# EAGLE design ram (EAGLE 9.6.2)
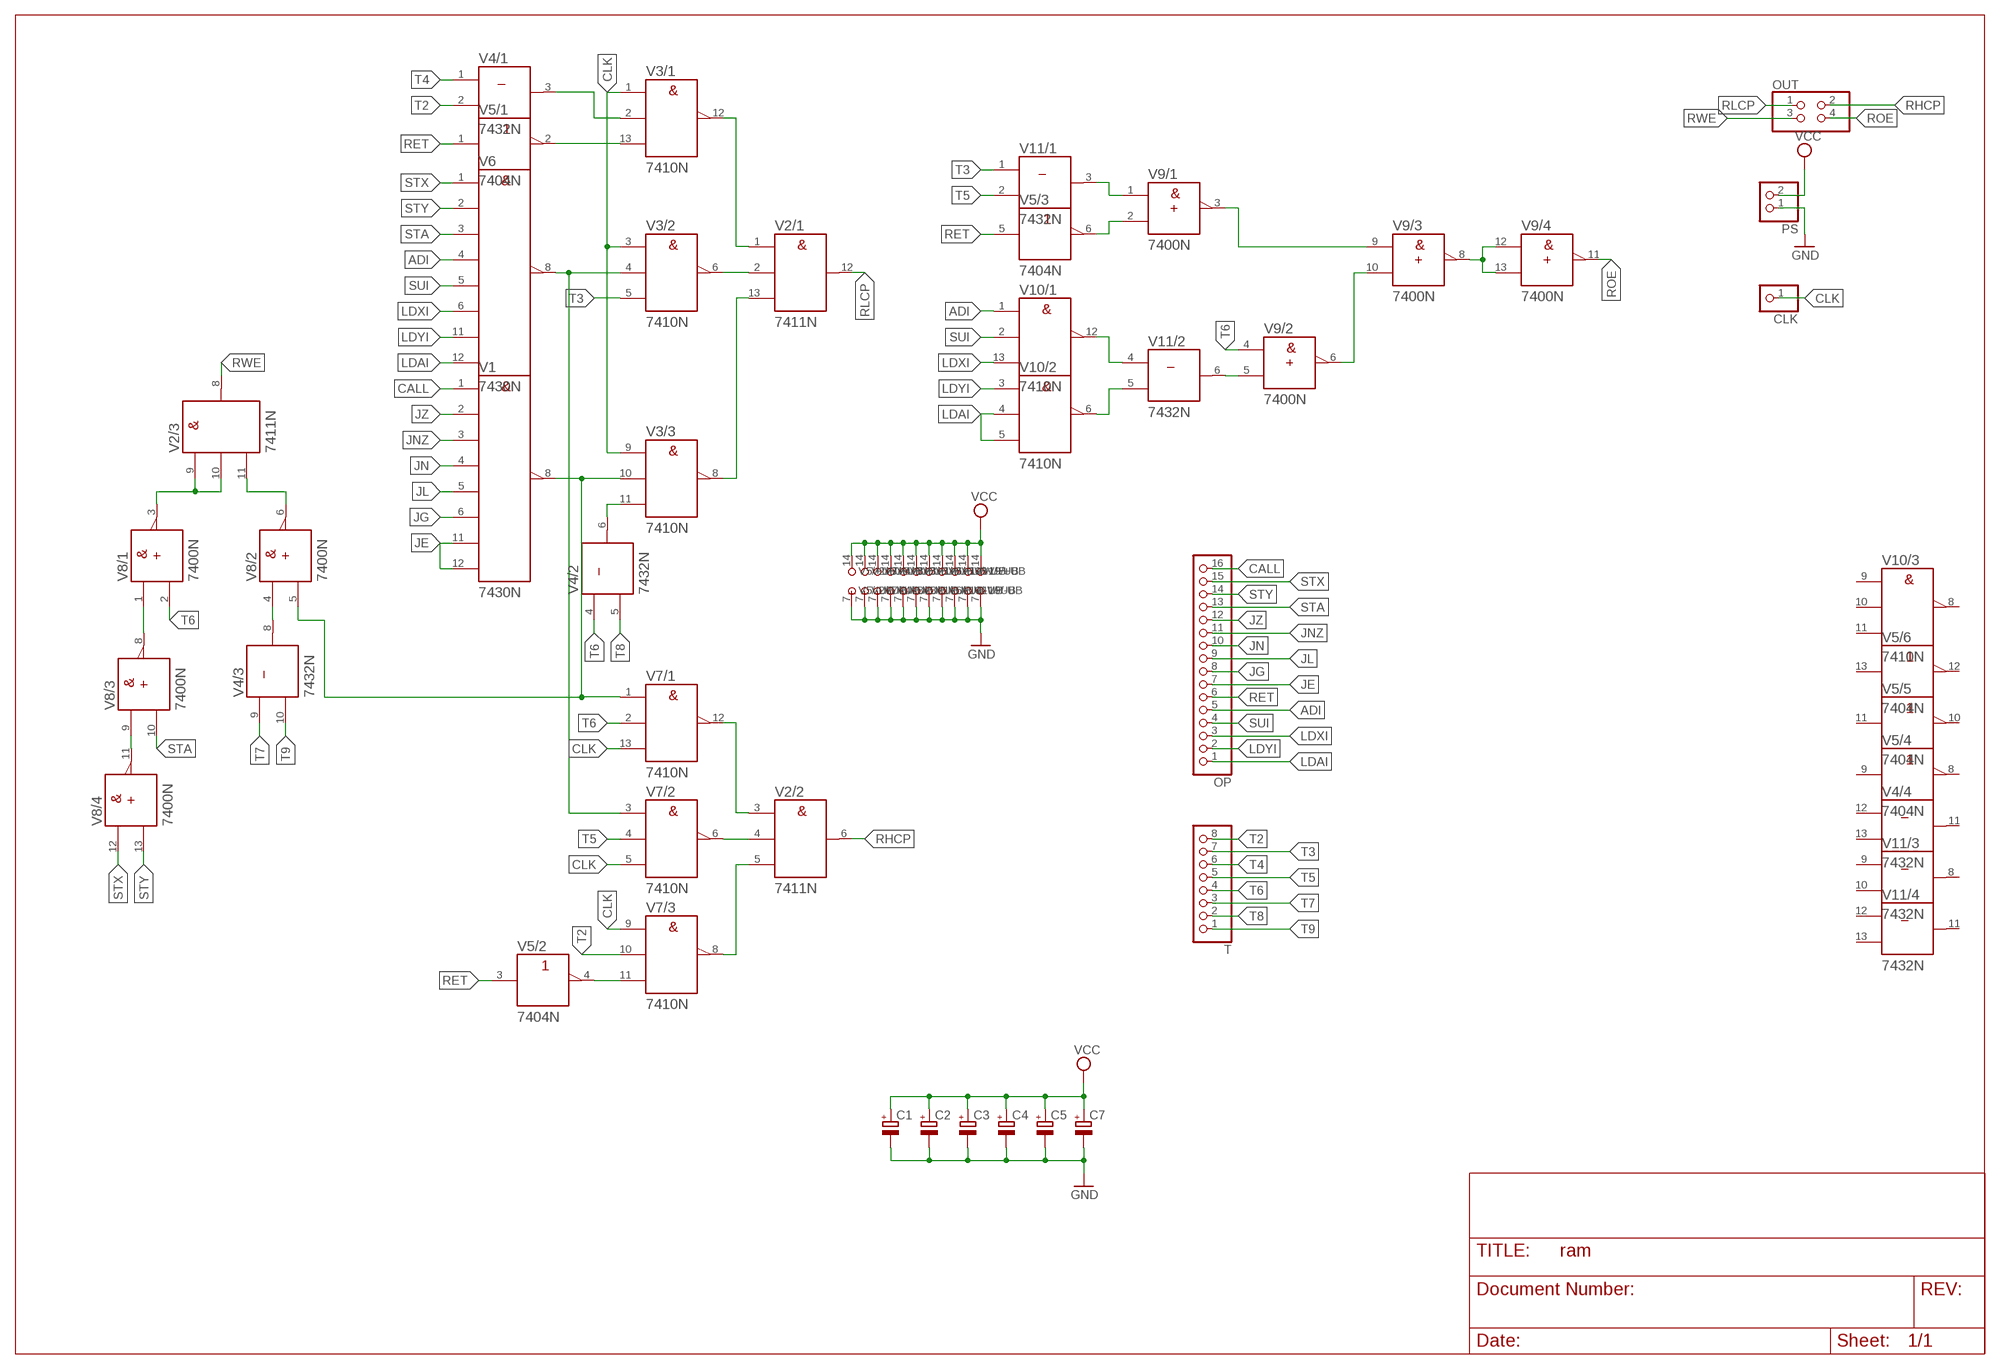
[diagram p0: schematic, sheet 1]

## Parts
C1  CPOL-EUE2.5-6  [E2,5-6]
C2  CPOL-EUE2.5-6  [E2,5-6]
C3  CPOL-EUE2.5-6  [E2,5-6]
C4  CPOL-EUE2.5-6  [E2,5-6]
C5  CPOL-EUE2.5-6  [E2,5-6]
C7  CPOL-EUE2.5-6  [E2,5-6]
CLK  PINHD-1X1  [1X01]
OP  PINHD-1X16  [1X16]
OUT  PINHD-2X2  [2X02]
PS  PINHD-1X2  [1X02]
T  PINHD-1X8  [1X08]
V1  7430N  [DIL14]
V2  7411N  [DIL14]
V3  7410N  [DIL14]
V4  7432N  [DIL14]
V5  7404N  [DIL14]
V6  7430N  [DIL14]
V7  7410N  [DIL14]
V8  7400N  [DIL14]
V9  7400N  [DIL14]
V10  7410N  [DIL14]
V11  7432N  [DIL14]

## Nets
ADI: OP.5 V6.4(D) V10.1(/1:A)
CALL: OP.16 V1.1(A)
CLK: CLK.1 V3.1(/1:A) V3.3(/2:A) V3.9(/3:A) V7.5(/2:C) V7.9(/3:A) V7.13(/1:C)
GND: C1.- C2.- C3.- C4.- C5.- C7.- PS.1 V1.7(-UB) V2.7(/-UB:-UB) V3.7(/-UB:-UB) V4.7(/-UB:-UB) V5.7(/-UB:-UB) V6.7(-UB) V7.7(/-UB:-UB) V8.7(/-UB:-UB) V9.7(/-UB:-UB) V10.7(/-UB:-UB) V11.7(/-UB:-UB)
JE: OP.7 V1.11(G) V1.12(H)
JG: OP.8 V1.6(F)
JL: OP.9 V1.5(E)
JN: OP.10 V1.4(D)
JNZ: OP.11 V1.3(C)
JZ: OP.12 V1.2(B)
LDAI: OP.1 V6.12(H) V10.4(/2:B) V10.5(/2:C)
LDXI: OP.3 V6.6(F) V10.13(/1:C)
LDYI: OP.2 V6.11(G) V10.3(/2:A)
N$1: V2.5(/2:C) V7.8(/3:Y)
N$2: V2.2(/1:B) V3.6(/2:Y)
N$3: V2.1(/1:A) V3.12(/1:Y)
N$4: V2.13(/1:C) V3.8(/3:Y)
N$5: V3.2(/1:B) V4.3(/1:Y)
N$6: V3.13(/1:C) V5.2(/1:Y)
N$7: V3.4(/2:B) V6.8(Y) V7.3(/2:A)
N$8: V9.1(/1:A) V11.3(/1:Y)
N$9: V2.4(/2:B) V7.6(/2:Y)
N$10: V3.11(/3:C) V4.6(/2:Y)
N$11: V2.3(/2:A) V7.12(/1:Y)
N$12: V2.9(/3:A) V2.10(/3:B) V8.3(/1:Y)
N$13: V2.11(/3:C) V8.6(/2:Y)
N$14: V5.4(/2:Y) V7.11(/3:C)
N$15: V9.3(/1:Y) V9.9(/3:A)
N$16: V9.5(/2:B) V11.6(/2:Y)
N$17: V8.9(/3:A) V8.11(/4:Y)
N$18: V4.8(/3:Y) V8.4(/2:A)
N$19: V8.1(/1:A) V8.8(/3:Y)
N$20: V1.8(Y) V3.10(/3:B) V7.1(/1:A) V8.5(/2:B)
N$21: V5.6(/3:Y) V9.2(/1:B)
N$22: V9.8(/3:Y) V9.12(/4:A) V9.13(/4:B)
N$23: V10.6(/2:Y) V11.5(/2:B)
N$24: V10.12(/1:Y) V11.4(/2:A)
N$25: V9.6(/2:Y) V9.10(/3:B)
RET: OP.6 V5.1(/1:A) V5.3(/2:A) V5.5(/3:A)
RHCP: OUT.2 V2.6(/2:Y)
RLCP: OUT.1 V2.12(/1:Y)
ROE: OUT.4 V9.11(/4:Y)
RWE: OUT.3 V2.8(/3:Y)
STA: OP.13 V6.3(C) V8.10(/3:B)
STX: OP.15 V6.1(A) V8.12(/4:A)
STY: OP.14 V6.2(B) V8.13(/4:B)
SUI: OP.4 V6.5(E) V10.2(/1:B)
T2: T.8 V4.2(/1:B) V7.10(/3:B)
T3: T.7 V3.5(/2:C) V11.1(/1:A)
T4: T.6 V4.1(/1:A)
T5: T.5 V7.4(/2:B) V11.2(/1:B)
T6: T.4 V4.4(/2:A) V7.2(/1:B) V8.2(/1:B) V9.4(/2:A)
T7: T.3 V4.9(/3:A)
T8: T.2 V4.5(/2:B)
T9: T.1 V4.10(/3:B)
VCC: C1.+ C2.+ C3.+ C4.+ C5.+ C7.+ PS.2 V1.14(+UB) V2.14(/+UB:+UB) V3.14(/+UB:+UB) V4.14(/+UB:+UB) V5.14(/+UB:+UB) V6.14(+UB) V7.14(/+UB:+UB) V8.14(/+UB:+UB) V9.14(/+UB:+UB) V10.14(/+UB:+UB) V11.14(/+UB:+UB)
Unconnected: V4.11(/4:Y) V4.12(/4:A) V4.13(/4:B) V5.8(/4:Y) V5.9(/4:A) V5.10(/5:Y) V5.11(/5:A) V5.12(/6:Y) V5.13(/6:A) V10.8(/3:Y) V10.9(/3:A) V10.10(/3:B) V10.11(/3:C) V11.8(/3:Y) V11.9(/3:A) V11.10(/3:B) V11.11(/4:Y) V11.12(/4:A) V11.13(/4:B)

## Library data of the parts
C1-C5 C7 = rcl:CPOL-EU: POLARIZED CAPACITOR, European symbol; SPICEPREFIX: C
CLK = pinhead:PINHD-1X1: PIN HEADER
OP = pinhead:PINHD-1X16: PIN HEADER
OUT = pinhead:PINHD-2X2: PIN HEADER
PS = pinhead:PINHD-1X2: PIN HEADER
T = pinhead:PINHD-1X8: PIN HEADER
V1 V6 = 74ttl-din:74*30: 8-input NAND gate
V2 = 74ttl-din:74*11: Triple 3-input AND gate
V3 V7 V10 = 74ttl-din:74*10: Triple 3-input NAND gate
V4 V11 = 74ttl-din:74*32: Quad 2-input OR gate
V5 = 74ttl-din:74*04: Hex INVERTER
V8 V9 = 74ttl-din:74*00: Quad 2-input NAND gate

## Board
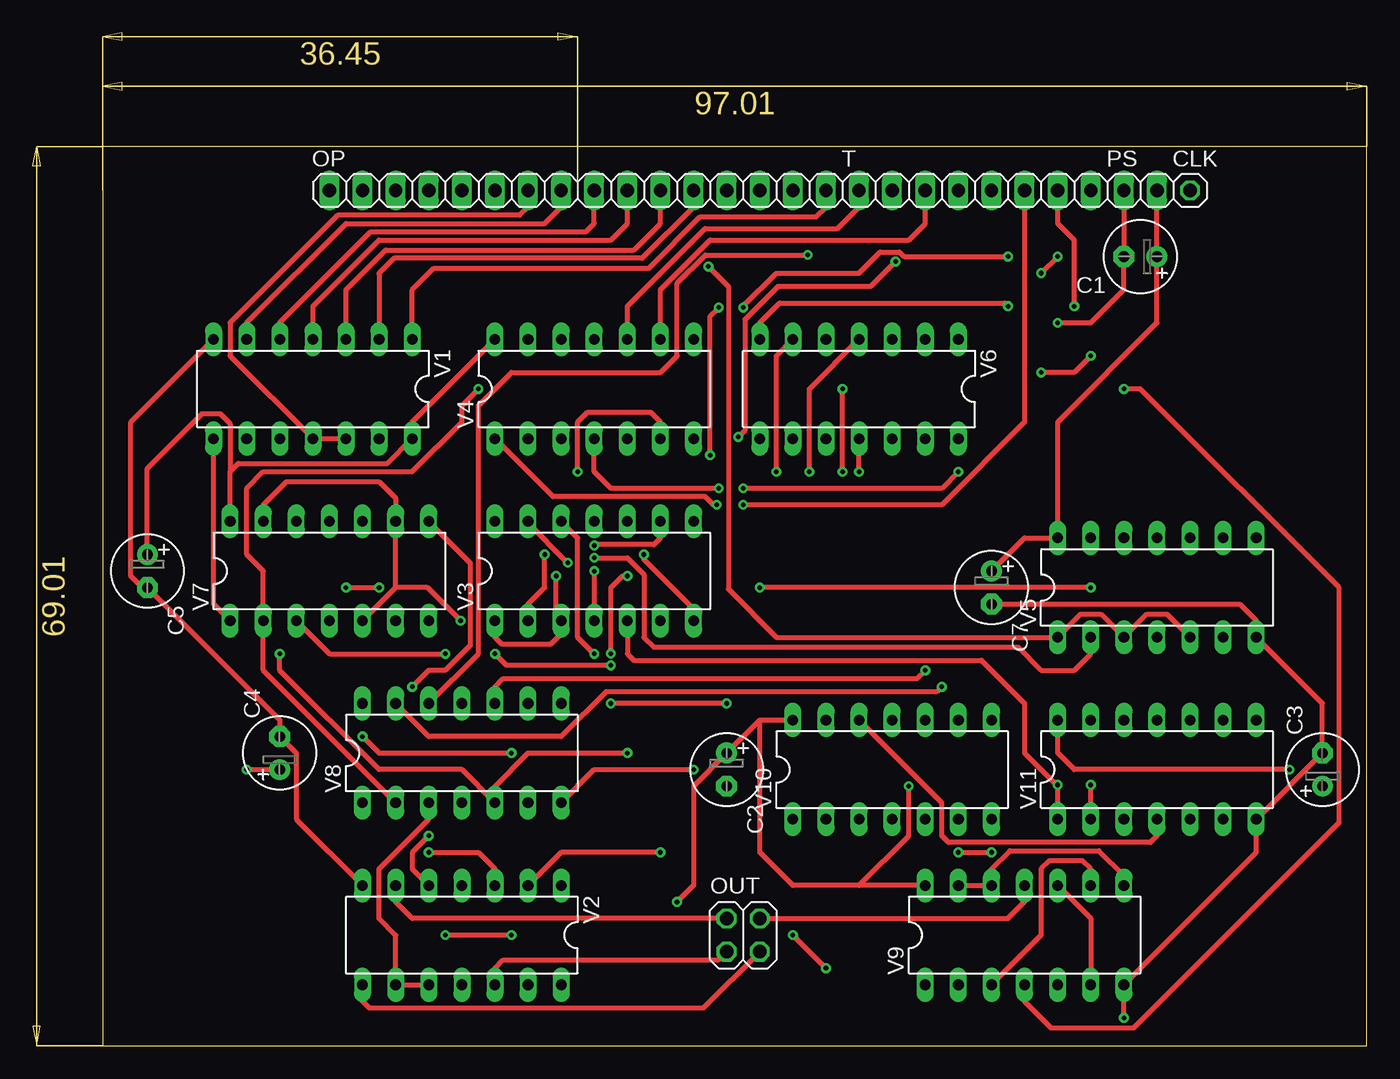
[diagram p1: board, top side]
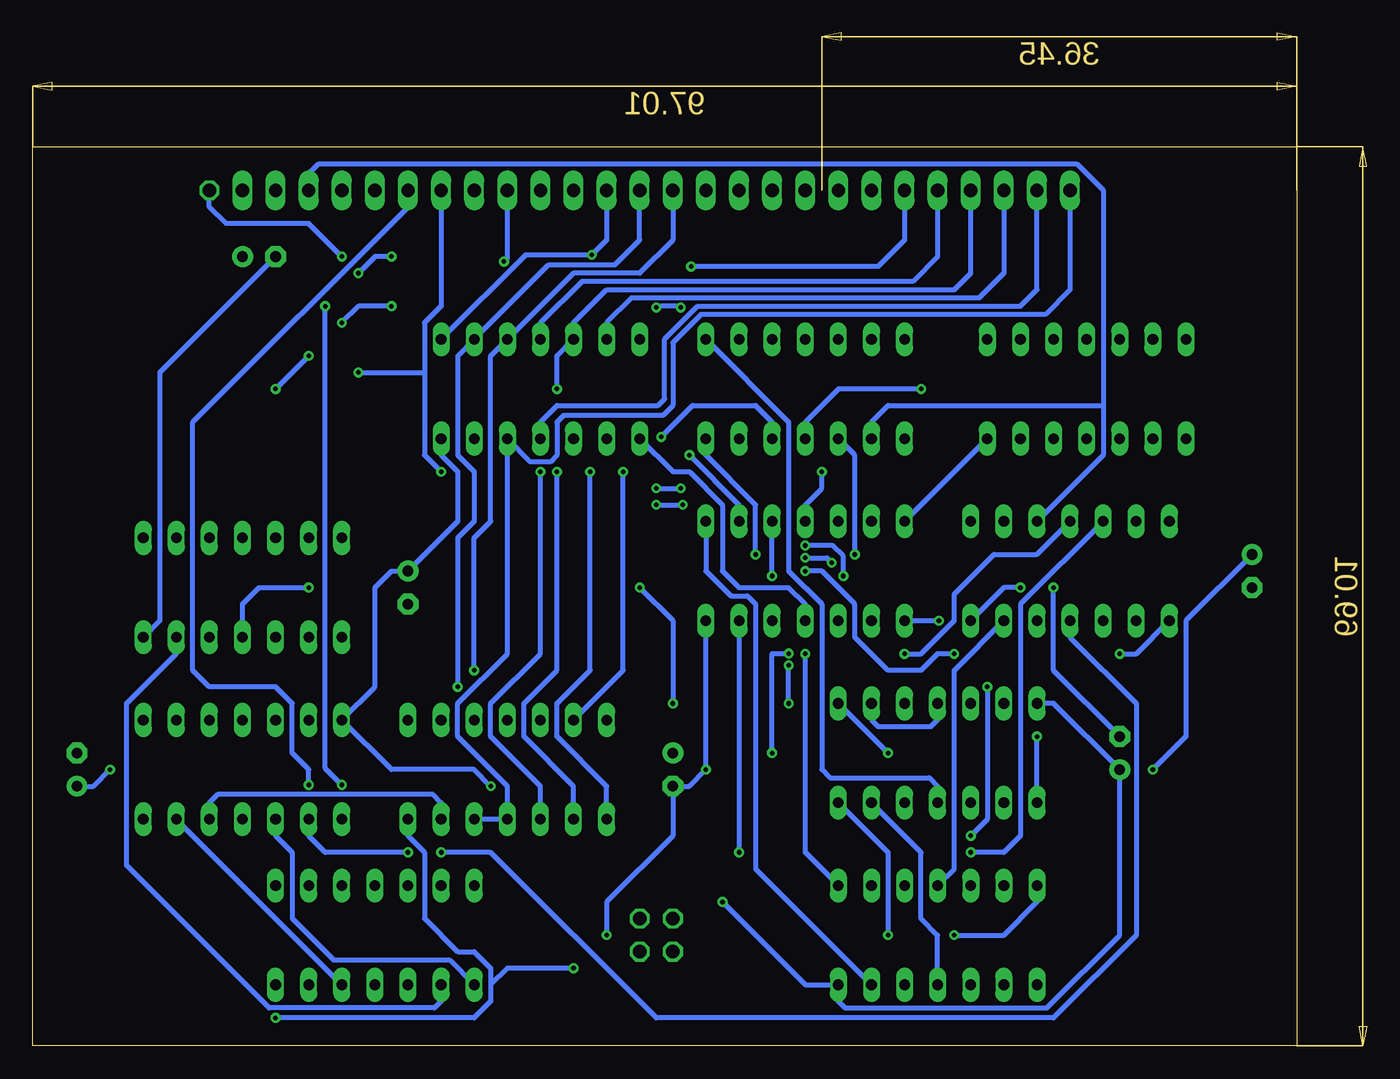
[diagram p2: board, bottom side, seen from below]

Size 97.01 x 69.01 mm. Coordinates in mm from the lower left corner, seen from the top.
Outline: 0,0 97.01,0 97.01,69.01 0,69.01 0,0
Copper layers (1*16): Top 0.035mm / dielectric 1.5mm / Bottom 0.035mm
Design rules "default": minimum track width 6mil, minimum drill 0.35mm, track to track 6mil, track to pad 6mil, pad to pad 6mil, via to via 6mil, smd to smd 6mil, copper to edge 40mil, drill to drill 6mil, minimum pad ring 10mil, minimum via ring 8mil, stop-mask expansion 4mil, vias tented up to drill 0mil, thermal gap 10mil

### Footprints (pad centres in the part's own frame; a part is rotated, then mirrored left to right if it is on the bottom)
E2,5-6 = drill 0.813 pad 1.6: + -1.27,0 | drill 0.813 pad 1.6 octagon: - 1.27,0
1X01 = drill 1.016 octagon: 1 0,0
1X16 = drill 1.016 long: 1 -19.05,0; 2 -16.51,0; 3 -13.97,0; 4 -11.43,0; 5 -8.89,0; 6 -6.35,0; 7 -3.81,0; 8 -1.27,0; 9 1.27,0; 10 3.81,0; 11 6.35,0; 12 8.89,0; 13 11.43,0; 14 13.97,0; 15 16.51,0; 16 19.05,0
2X02 = drill 1.016 octagon: 1 -1.27,-1.27; 2 -1.27,1.27; 3 1.27,-1.27; 4 1.27,1.27
1X02 = drill 1.016 long: 1 -1.27,0; 2 1.27,0
1X08 = drill 1.016 long: 1 -8.89,0; 2 -6.35,0; 3 -3.81,0; 4 -1.27,0; 5 1.27,0; 6 3.81,0; 7 6.35,0; 8 8.89,0
DIL14 = drill 0.813 long: 1 -7.62,-3.81; 2 -5.08,-3.81; 3 -2.54,-3.81; 4 0,-3.81; 5 2.54,-3.81; 6 5.08,-3.81; 7 7.62,-3.81; 8 7.62,3.81; 9 5.08,3.81; 10 2.54,3.81; 11 0,3.81; 12 -2.54,3.81; 13 -5.08,3.81; 14 -7.62,3.81

### Placement (x,y rotation side)
C1  79.63,60.58 180 top
C2  47.88,21.21 270 top
C3  93.6,21.21 90 top
C4  13.59,22.48 90 top
C5  3.43,36.45 270 top
C7  68.2,35.18 270 top
CLK  83.44,65.66 0 top
OP  36.45,65.66 0 top
OUT  49.15,8.51 0 top
PS  79.63,65.66 0 top
T  66.93,65.66 0 top
V1  16.13,50.42 180 top
V2  27.56,8.51 180 top
V3  37.72,36.45 0 top
V4  37.72,50.42 0 top
V5  80.9,35.18 0 top
V6  58.04,50.42 180 top
V7  17.4,36.45 0 top
V8  27.56,22.48 0 top
V9  70.74,8.51 0 top
V10  60.58,21.21 0 top
V11  80.9,21.21 0 top

### Tracks (layer width: path | path; a pad name or v marks a point on that pad's centre or on a via)
ADI  (via drill 0.35)
  Top 0.4: v54.23,44.07 54.23,50.42 V6.4
  Bottom 0.4: OP.5 27.56,60.58 29.46,58.67 54.86,58.67 58.04,55.5 V6.4 | V10.1 52.96,19.94 56.77,23.75 56.77,26.29 54.23,28.83 v54.23,44.07
CALL
  Top 0.4: OP.16 55.5,64.39 54.74,63.63 45.85,63.63 41.91,59.69 25.4,59.69 23.75,58.04 V1.1
CLK  (via drill 0.35)
  Top 0.4: V7.13 12.32,41.53 14.1,43.31 21.21,43.31 22.48,42.04 V7.9 22.48,35.18 | V7.5 22.48,35.18 | V3.1 30.1,31.37 30.61,30.86 34.42,30.86 35.18,31.62 V3.3 34.8,33.02 v34.8,36.07 | v46.61,45.34 46.61,56.01 v47.27,56.67 | v49.15,56.67 49.15,56.77 51.69,59.31 58.04,59.31 59.66,60.93 61.14,60.93 61.48,60.58 v69.47,60.58 | v72.01,59.31 v73.28,60.58 | v27.46,32.64 24.92,35.18 22.48,35.18 | V3.9 42.8,38.99 42.29,38.48 37.79,38.48 v37.72,38.41
  Bottom 0.4: V3.9 42.8,41.53 v46.61,45.34 | v47.27,56.67 47.37,56.77 49.15,56.77 v49.15,56.67 | v69.47,60.58 70.74,60.58 v72.01,59.31 | v73.28,60.58 75.82,63.12 82.17,63.12 83.44,64.39 CLK.1 | V3.1 v27.46,32.64 | v34.8,36.07 34.8,37.59 35.61,38.41 v37.72,38.41
GND  (via drill 0.35)
  Top 0.4: V1.7 2.16,47.88 2.16,36.07 3.05,35.18 C5.- 13.59,25.02 C4.- 14.86,22.48 14.86,17.4 V2.7 | C7.- 87.25,33.91 88.52,32.64 V5.7 93.6,26.29 C3.- V11.7 88.52,14.86 V9.7 v78.36,2.16 | PS.1 C1.- 78.36,58.04 75.82,55.5 v73.28,55.5 | V6.7 50.42,55.5 51.94,57.02 69.22,57.02 v69.47,56.77 | V3.7 45.34,33.53 41.53,37.34 v41.53,37.72 | v31.37,8.51 v26.29,8.51 | V8.7 37.72,21.21 v45.34,21.21 | v18.67,35.18 v21.21,35.18 | v52.96,8.51 v55.5,5.97
  Bottom 0.4: V10.7 68.2,16.13 66.93,14.86 66.93,9.78 64.39,7.24 63.12,7.24 61.85,5.97 61.85,4.7 | 61.85,4.7 61.85,3.43 63.12,2.16 v78.36,2.16 | v69.47,56.77 72.01,56.77 v73.28,55.5 | v41.53,37.72 41.53,41.53 45.34,45.34 V4.7 | V3.7 v45.34,21.21 46.61,19.94 C2.- 47.88,16.13 52.96,11.05 v52.96,8.51 | V8.7 31.37,14.86 v31.37,8.51 | v26.29,8.51 22.48,8.51 19.94,11.05 V2.7 | C4.- 18.67,28.83 v18.67,35.18 | v21.21,35.18 22.48,35.18 V7.7 | v55.5,5.97 60.58,5.97 61.85,4.7 | C1.- 87.25,51.69 87.25,32.64 V5.7
JE
  Top 0.4: V1.12 V1.11 9.78,52.96 9.78,55.5 18.03,63.75 32,63.75 32.64,64.39 OP.7
JG
  Top 0.4: V1.6 11.05,55.5 18.67,63.12 33.91,63.12 35.18,64.39 OP.8
JL
  Top 0.4: V1.5 13.59,55.5 20.57,62.48 37.08,62.48 37.72,63.12 OP.9
JN
  Top 0.4: OP.10 40.26,63.12 38.99,61.85 21.21,61.85 16.13,56.77 V1.4
JNZ
  Top 0.4: OP.11 42.8,63.12 40.77,61.09 21.72,61.09 18.67,58.04 V1.3
JZ
  Top 0.4: OP.12 45.34,64.39 41.4,60.45 22.35,60.45 21.21,59.31 V1.2
LDAI
  Bottom 0.4: OP.1 17.4,58.04 19.3,56.13 45.72,56.13 47.88,53.98 47.88,49.15 48.64,48.39 56.26,48.39 56.77,47.88 56.77,45.34 57.28,44.83 58.8,44.83 V6.12 60.58,30.1 64.39,26.29 64.39,23.75 60.58,19.94 V10.4 V10.5
LDXI  (via drill 0.35)
  Top 0.4: v51.69,44.07 51.69,52.96 V6.6
  Bottom 0.4: OP.3 22.48,59.31 24.38,57.4 51.05,57.4 52.96,55.5 V6.6 | V10.13 51.69,28.83 v51.69,44.07
LDYI  (via drill 0.35)
  Top 0.4: v58.04,44.07 V6.11
  Bottom 0.4: V6.11 58.04,47.88 56.77,49.15 49.02,49.15 48.51,49.66 48.51,54.23 45.97,56.77 21.21,56.77 19.94,58.04 OP.2 | v58.04,44.07 58.04,30.1 61.85,26.29 61.85,23.75 58.04,19.94 V10.3
N$1  (via drill 0.35)
  Top 0.4: V7.8 28.19,37.08 28.19,30.73 26.29,28.83 25.02,28.83 v23.75,27.56 | v25.02,16.13 23.75,14.86 23.75,13.59 V2.5
  Bottom 0.4: v23.75,27.56 23.75,17.4 v25.02,16.13
N$2  (via drill 0.35)
  Top 0.4: v42.8,14.86 35.18,14.86 V2.2
  Bottom 0.4: V3.6 v42.8,14.86
N$3  (via drill 0.35)
  Top 0.4: v37.72,30.1 36.45,31.37 36.45,38.99 V3.12
  Bottom 0.4: V2.1 37.72,14.86 v37.72,30.1
N$4
  Bottom 0.4: V2.13 41.53,13.59 41.53,33.91 42.16,34.54 43.43,34.54 45.34,36.45 V3.8
N$5  (via drill 0.35)
  Top 0.4: V3.2 32.64,33.91 33.91,35.18 v33.91,37.72
  Bottom 0.4: V4.3 33.91,45.34 v33.91,37.72
N$6  (via drill 0.35)
  Top 0.4: v35.69,37.08 32.64,40.13 V3.13 | v37.72,37.47 40.26,37.47 41.53,36.2 41.53,31.37 42.29,30.61 70.23,30.61 72.01,28.83 74.55,28.83 75.82,30.1 V5.2
  Bottom 0.4: v35.69,37.08 36.07,37.47 v37.72,37.47
N$7  (via drill 0.35)
  Top 0.4: V7.3 17.4,30.1 v26.29,30.1 | v37.72,36.45 V3.4
  Bottom 0.4: V3.4 37.72,33.91 38.99,35.18 42.8,35.18 44.07,36.45 44.07,41.53 46.61,44.07 47.88,44.07 V6.8 | v26.29,30.1 27.56,30.1 28.83,28.83 31.37,28.83 33.91,31.37 33.91,33.91 36.45,36.45 v37.72,36.45
N$8
  Bottom 0.4: V11.3 78.36,16.13 77.09,14.86 77.09,9.78 73.91,6.6 65.02,6.6 V9.1
N$9
  Bottom 0.4: V2.4 26.29,13.59 26.29,28.83 V7.6
N$10  (via drill 0.35)
  Top 0.4: v36.45,44.07 36.45,47.88 37.21,48.64 42.04,48.64 42.8,47.88 V4.6
  Bottom 0.4: V3.11 37.72,41.53 36.45,42.8 v36.45,44.07
N$11  (via drill 0.35)
  Top 0.4: v25.02,14.86 28.83,14.86 30.1,13.59 V2.3
  Bottom 0.4: V7.12 21.21,33.91 21.21,16.13 22.48,14.86 v25.02,14.86
N$12
  Top 0.4: V2.10 V2.9 22.48,8.51 21.21,9.78 21.21,13.59 25.02,17.4 V8.3
N$13
  Bottom 0.4: V2.11 27.56,8.51 28.83,9.78 28.83,14.86 V8.6
N$14  (via drill 0.35)
  Top 0.4: v75.82,35.18 v50.42,35.18 | v47.88,26.29 v38.99,26.29 | v30.1,30.1 30.99,29.21 v38.99,29.21
  Bottom 0.4: V5.4 80.9,33.91 79.63,35.18 v75.82,35.18 | v50.42,35.18 47.88,32.64 v47.88,26.29 | v30.1,30.1 28.83,30.1 26.29,32.64 26.29,34.67 23.24,37.72 19.94,37.72 V7.11 | v38.99,26.29 v38.99,29.21
N$15
  Top 0.4: V9.9 75.82,13.59 75.18,14.22 72.64,14.22 72.01,13.59 72.01,8.51 V9.3
N$16
  Bottom 0.4: V9.5 V11.6
N$17
  Bottom 0.4: V8.9 32.64,25.02 32.13,24.51 28.07,24.51 27.56,25.02 V8.11
N$18
  Bottom 0.4: V4.8 38.99,47.88 38.99,36.45 36.45,33.91 36.45,21.21 35.81,20.57 28.19,20.57 27.56,19.94 V8.4
N$19  (via drill 0.35)
  Top 0.4: v19.94,23.75 21.21,22.48 v31.37,22.48
  Bottom 0.4: V8.1 v19.94,23.75 | v31.37,22.48 V8.8
N$20  (via drill 0.35)
  Top 0.4: V7.1 8.51,33.91 V1.8 | v13.59,30.1 13.59,28.83 21.21,21.21 27.56,21.21 V8.5 30.1,19.94 32.64,22.48 v40.26,22.48 | v38.99,30.12 38.99,35.18 39.88,36.07 v40.26,36.07
  Bottom 0.4: v13.59,30.1 12.32,30.1 V7.1 | v40.26,22.48 40.26,30.1 40.24,30.12 v38.99,30.12 | v40.26,36.07 V3.10
N$21
  Bottom 0.4: V9.2 65.66,3.43 66.17,2.92 78.87,2.92 89.79,13.84 89.79,26.29 85.98,30.1 V5.6
N$22
  Top 0.4: V9.8 78.36,13.08 76.45,14.99 69.6,14.99 68.2,13.59 V9.12 V9.13
N$23
  Bottom 0.4: V10.6 65.66,18.67 66.29,19.3 82.8,19.3 83.44,18.67 V11.5
N$24
  Top 0.4: V11.4 80.9,16.13 80.39,15.62 64.9,15.62 64.39,16.13 64.39,18.67 V10.12
N$25
  Top 0.4: V9.10 75.82,9.78 V9.6
RET  (via drill 0.35)
  Top 0.4: v46.48,59.82 48.01,58.29 48.01,35.05 51.69,31.37 V5.1 75.06,33.15 76.58,33.15 V5.3 80.14,33.15 81.66,33.15 V5.5
  Bottom 0.4: OP.6 30.1,61.85 32.13,59.82 v46.48,59.82
RHCP
  Top 0.4: OUT.2 23.75,9.78 22.48,11.05 V2.6
RLCP
  Top 0.4: V2.12 30.1,5.97 30.73,6.6 47.24,6.6 OUT.1
ROE
  Top 0.4: OUT.4 69.47,9.78 70.74,11.05 V9.11
RWE
  Top 0.4: V2.8 19.94,3.43 20.45,2.92 46.1,2.92 OUT.3
STA  (via drill 0.35)
  Top 0.4: V8.10 30.1,27.56 30.73,28.19 62.48,28.19 v63.12,28.83
  Bottom 0.4: OP.13 47.88,61.85 50.42,59.31 55.5,59.31 V6.3 61.85,52.96 61.85,40.26 63.12,38.99 v63.12,28.83
STX  (via drill 0.35)
  Top 0.4: V8.12 28.83,30.1 28.83,49.15 31.37,51.69 42.8,51.69 44.07,52.96 44.07,58.53 46.25,60.71 v54.1,60.71
  Bottom 0.4: OP.15 52.96,61.85 v54.1,60.71 59.18,60.71 V6.1
STY  (via drill 0.35)
  Top 0.4: v64.39,27.56 64.01,27.18 38.61,27.18 35.18,23.75 25.02,23.75 V8.13
  Bottom 0.4: OP.14 50.42,61.85 52.32,59.94 57.4,59.94 V6.2 64.39,52.96 64.39,45.34 63.12,44.07 63.12,40.26 64.39,38.99 v64.39,27.56
SUI  (via drill 0.35)
  Top 0.4: v56.77,44.07 v56.77,50.42
  Bottom 0.4: OP.4 25.02,59.31 26.29,58.04 52.96,58.04 55.5,55.5 V6.5 56.77,52.96 v56.77,50.42 | V10.2 55.5,19.94 59.31,23.75 59.31,26.29 56.77,28.83 v56.77,44.07
T2
  Bottom 0.4: T.8 75.82,66.93 75.06,67.69 16.89,67.69 14.86,65.66 14.86,49.15 | V7.10 14.86,45.34 14.86,49.15 | V4.2 32.64,47.88 31.37,49.15 14.86,49.15
T3  (via drill 0.35)
  Top 0.4: v74.55,56.77 74.55,61.85 73.28,63.12 T.7 | V11.1 v73.28,20.04 73.18,20.04 70.74,22.48 70.74,26.29 67.44,29.59 40.77,29.59 40.26,30.1 V3.5
  Bottom 0.4: v73.28,20.04 74.55,21.3 v74.55,56.77
T4  (via drill 0.35)
  Top 0.4: T.6 70.74,47.88 64.39,41.53 v49.15,41.53 | v47.12,41.53 46.86,41.53 46.23,42.16 34.54,42.16 V4.1
  Bottom 0.4: v49.15,41.53 v47.12,41.53
T5  (via drill 0.35)
  Top 0.4: V11.2 v75.82,20.04 | v65.66,14.86 v68.2,14.86
  Bottom 0.4: v75.82,20.04 75.82,21.21 77.09,22.48 77.09,26.29 78.36,27.56 83.44,27.56 84.71,28.83 84.71,47.88 68.2,64.39 T.5 | V7.4 17.4,31.37 12.32,26.29 12.32,8.51 18.67,2.16 49.15,2.16 61.85,14.86 v65.66,14.86 | v68.2,14.86 74.55,14.86 75.82,16.13 V11.2
T6  (via drill 0.35)
  Top 0.4: v47.27,42.8 38.99,42.8 37.72,44.07 V4.4 | v65.66,44.07 64.39,42.8 v49.15,42.8 | v28.83,50.42 27.56,49.15 27.56,47.88 23.75,44.07 12.32,44.07 11.05,42.8 11.05,37.72 12.32,36.45 V7.2 12.32,28.83 V8.2 | V9.4 70.74,3.43 72.77,1.4 79.12,1.4 94.87,17.14 94.87,35.18 79.63,50.42 v78.36,50.42 | v75.82,52.96 74.55,51.69 v72.01,51.69
  Bottom 0.4: T.4 65.66,56.77 66.93,55.5 66.93,51.69 | 66.93,51.69 66.93,45.34 v65.66,44.07 | v49.15,42.8 v47.27,42.8 | v28.83,50.42 35.18,50.42 37.72,47.88 V4.4 | v78.36,50.42 v75.82,52.96 | v72.01,51.69 66.93,51.69
T7
  Top 0.4: T.3 63.12,63.12 61.85,61.85 46.61,61.85 42.8,58.04 V4.9
T8  (via drill 0.35)
  Top 0.4: v60.83,60.2 58.93,58.29 51.82,58.29 49.28,55.75 49.28,47.24 v48.77,46.74
  Bottom 0.4: v48.77,46.74 46.35,49.15 41.53,49.15 40.26,47.88 V4.5 | v60.83,60.2 60.58,60.45 T.2
T9
  Top 0.4: V4.10 40.26,56.77 46.23,62.74 56.39,62.74 58.04,64.39 T.1
VCC  (via drill 0.35)
  Top 0.4: V4.14 23.75,47.88 V1.14 21.84,44.7 10.41,44.7 9.78,44.07 | V7.14 9.78,44.07 | C5.+ 3.43,44.32 7.62,48.51 9.02,48.51 9.78,47.75 9.78,44.07 | C7.+ 70.74,38.99 V5.14 73.28,47.88 80.9,55.5 C1.+ PS.2 | 50.42,25.02 C2.+ 45.34,19.94 45.34,12.32 v44.07,11.05 | 50.42,25.02 V10.14 | V9.14 58.04,12.32 | 58.04,12.32 52.96,12.32 50.42,14.86 50.42,25.02 | v91.06,21.21 74.55,21.21 73.28,22.48 V11.14 | v61.85,19.94 61.85,16.13 58.04,12.32 | v11.05,21.21 C4.+
  Bottom 0.4: C3.+ 92.33,19.94 v91.06,21.21 | V8.14 18.67,26.29 C4.+ 13.59,8.51 19.18,2.92 34.67,2.92 35.18,3.43 V2.14 37.72,4.7 v44.07,11.05 | V3.14 V1.14 | V6.14 65.66,45.34 64.39,44.07 64.39,40.26 C7.+ 69.47,36.45 70.74,35.18 70.74,27.56 V11.14 69.47,21.21 63.12,21.21 v61.85,19.94 | C5.+ 8.51,32.64 8.51,23.75 v11.05,21.21